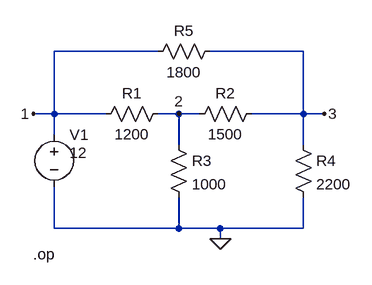
[diagram p0: schematic nodal1.asc]
nodal1.asc, the LTspice schematic file:
Version 4
SHEET 1 880 680
WIRE 144 16 -16 16
WIRE 368 16 224 16
WIRE -16 112 -16 16
WIRE -16 112 -48 112
WIRE 64 112 -16 112
WIRE 176 112 144 112
WIRE 208 112 176 112
WIRE 368 112 368 16
WIRE 368 112 288 112
WIRE 400 112 368 112
WIRE -16 144 -16 112
WIRE 176 160 176 112
WIRE 368 160 368 112
WIRE -16 288 -16 224
WIRE 176 288 176 240
WIRE 176 288 -16 288
WIRE 240 288 176 288
WIRE 368 288 368 240
WIRE 368 288 240 288
WIRE 240 304 240 288
FLAG 176 112 2
FLAG 400 112 3
FLAG 240 304 0
FLAG -48 112 1
SYMBOL voltage -16 128 R0
WINDOW 3 24 44 Left 2
WINDOW 123 0 0 Left 0
WINDOW 39 0 0 Left 0
SYMATTR Value 12
SYMATTR InstName V1
SYMBOL res 48 128 R270
WINDOW 0 32 56 VTop 2
WINDOW 3 0 56 VBottom 2
SYMATTR InstName R1
SYMATTR Value 1200
SYMBOL res 304 96 R90
WINDOW 0 0 56 VBottom 2
WINDOW 3 32 56 VTop 2
SYMATTR InstName R2
SYMATTR Value 1500
SYMBOL res 160 144 R0
SYMATTR InstName R3
SYMATTR Value 1000
SYMBOL res 352 144 R0
SYMATTR InstName R4
SYMATTR Value 2200
SYMBOL res 128 32 R270
WINDOW 0 32 56 VTop 2
WINDOW 3 0 56 VBottom 2
SYMATTR InstName R5
SYMATTR Value 1800
TEXT -48 328 Left 2 !.op

The netlist it stands for:
* nodal1.asc
V1 1 0 12
R1 1 2 1200
R2 3 2 1500
R3 2 0 1000
R4 3 0 2200
R5 1 3 1800
.op
.backanno
.end